# EAGLE schematic HydraRelayBoard (EAGLE 5.10)
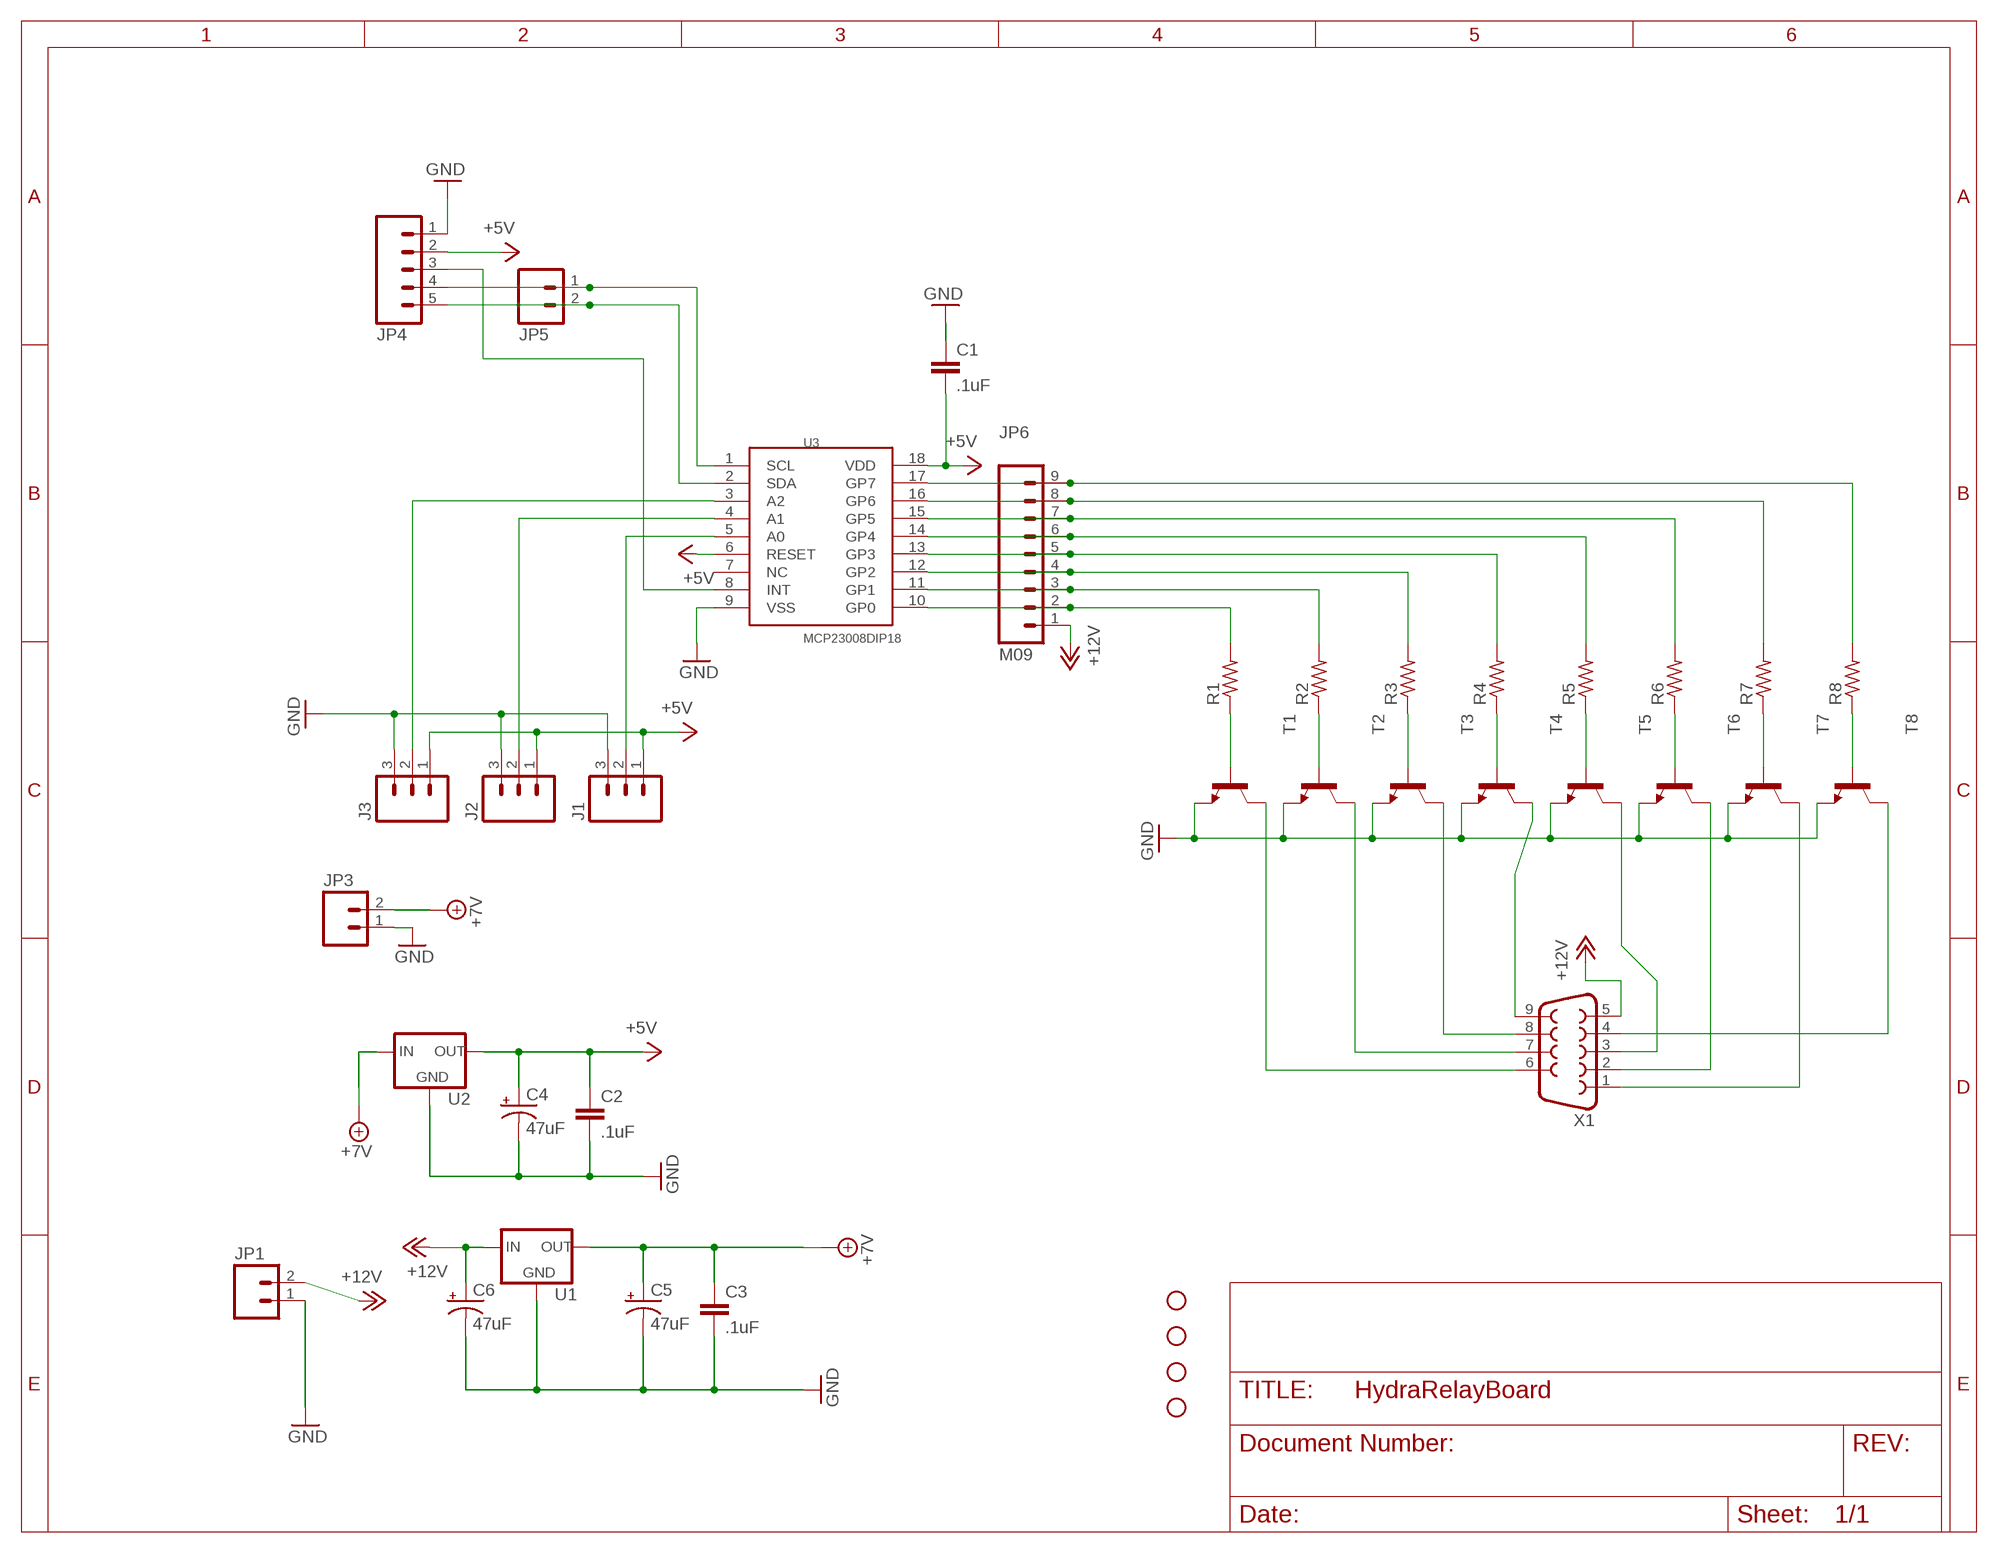
[diagram p0: schematic, sheet 1]

## Parts
C1  .1uF  CAPPTH  [CAP-PTH-SMALL]
C2  .1uF  CAPPTH  [CAP-PTH-SMALL]
C3  .1uF  CAPPTH  [CAP-PTH-SMALL]
C4  47uF  CAP_POL5MMPTH  [CAP5MM2MM]
C5  47uF  CAP_POL5MMPTH  [CAP5MM2MM]
C6  47uF  CAP_POL5MMPTH  [CAP5MM2MM]
J1  M03PTH  [1X03]
J2  M03PTH  [1X03]
J3  M03PTH  [1X03]
JP1  M02POLAR  [MOLEX-1X2]
JP3  M02POLAR  [MOLEX-1X2]
JP4  M05PTH  [1X05]
JP5  M02PTH  [1X02]
JP6  M09  [1X09]
JP9  STAND-OFF  [STAND-OFF]
JP10  STAND-OFF  [STAND-OFF]
JP11  STAND-OFF  [STAND-OFF]
JP12  STAND-OFF  [STAND-OFF]
R1  R-US_0204/5  [0204/5]
R2  R-US_0204/5  [0204/5]
R3  R-US_0204/5  [0204/5]
R4  R-US_0204/5  [0204/5]
R5  R-US_0204/5  [0204/5]
R6  R-US_0204/5  [0204/5]
R7  R-US_0204/5  [0204/5]
R8  R-US_0204/5  [0204/5]
T1  2N2222  [TO92-EBC-OVAL]
T2  2N2222  [TO92-EBC-OVAL]
T3  2N2222  [TO92-EBC-OVAL]
T4  2N2222  [TO92-EBC-OVAL]
T5  2N2222  [TO92-EBC-OVAL]
T6  2N2222  [TO92-EBC-OVAL]
T7  2N2222  [TO92-EBC-OVAL]
T8  2N2222  [TO92-EBC-OVAL]
U1  V_REG_78XXSINK  [TO220-IGO]
U2  V_REG_78XXSINK  [TO220-IGO]
U3  MCP23008DIP18  [DIL18]
X1  DB9  [DB9]

## Nets
+5V: C1.2 C2.1 C4.+ J1.1 J2.1 J3.1 JP4.2 U2.OUT U3.6(RESET) U3.18(VDD)
+7V: C3.1 C5.+ JP3.2 U1.OUT U2.IN
+12V: C6.+ JP1.2 JP6.1 U1.IN X1.5
GND: C1.1 C2.2 C3.2 C4.- C5.- C6.- J1.3 J2.3 J3.3 JP1.1 JP3.1 JP4.1 T1.E T2.E T3.E T4.E T5.E T6.E T7.E T8.E U1.GND U2.GND U3.9(VSS)
N$3: JP4.3 U3.8(INT)
N$6: J3.2 U3.3(A2)
N$7: J2.2 U3.4(A1)
N$8: J1.2 U3.5(A0)
N$9: JP4.4 JP5.1 U3.1(SCL)
N$10: T1.C X1.6
N$11: T2.C X1.7
N$12: JP6.7 R6.2 U3.15(GP5)
N$13: JP6.6 R5.2 U3.14(GP4)
N$14: JP6.5 R4.2 U3.13(GP3)
N$15: JP6.4 R3.2 U3.12(GP2)
N$16: JP6.3 R2.2 U3.11(GP1)
N$17: JP6.2 R1.2 U3.10(GP0)
N$18: JP4.5 JP5.2 U3.2(SDA)
N$19: JP6.9 R8.2 U3.17(GP7)
N$20: JP6.8 R7.2 U3.16(GP6)
N$21: T3.C X1.8
N$22: T4.C X1.9
N$23: R1.1 T1.B
N$24: R2.1 T2.B
N$25: R3.1 T3.B
N$26: R4.1 T4.B
N$28: R5.1 T5.B
N$29: R6.1 T6.B
N$30: R7.1 T7.B
N$31: R8.1 T8.B
N$32: T5.C X1.3
N$33: T6.C X1.2
N$34: T7.C X1.1
N$35: T8.C X1.4
Unconnected: U3.7(NC)

## Library data of the parts
C1-C3 = _allyourbase:CAP: Capacitor Standard 0603 ceramic capacitor, and 0.1" leaded capacitor.
C4-C6 = _allyourbase:CAP_POL: Capacitor Polarized These are standard SMD and PTH capacitors. Normally 10uF, 47uF, and 100uF in electrolytic and tantalum varieties. Always verify the external diameter of the through hole cap, it varies with capacity, voltage, and manufacturer. The EIA devices should be standard.
J1-J3 = _allyourbase:M03: Header 3 Standard 3-pin 0.1" header. Use with straight break away headers (SKU : PRT-00116), right angle break away headers (PRT-00553), swiss pins (PRT-00743), machine pins (PRT-00117), and female headers (PRT-00115). Molex polarized connector foot print use with SKU : PRT-08232 with associated crimp pins and housings.
JP1 JP3 JP5 = _allyourbase:M02: Header 2 Standard 2-pin 0.1" header. Use with straight break away headers (SKU : PRT-00116), right angle break away headers (PRT-00553), swiss pins (PRT-00743), machine pins (PRT-00117), and female headers (PRT-00115). Molex polarized connector foot print use with SKU : PRT-08233 with associated crimp pins and housings.
JP4 = _allyourbase:M05: Header 5 Standard 5-pin 0.1" header. Use with straight break away headers (SKU : PRT-00116), right angle break away headers (PRT-00553), swiss pins (PRT-00743), machine pins (PRT-00117), and female headers (PRT-00115). Molex polarized connector foot print use with SKU : PRT-08230 with associated crimp pins and housings.
JP6 = SparkFun:M09: Header 9 Standard 9-pin 0.1" header. Use with straight break away headers (SKU : PRT-00116), right angle break away headers (PRT-00553), swiss pins (PRT-00743), machine pins (PRT-00117), and female headers (PRT-00115).
JP9-JP12 = SparkFun:STAND-OFF: Stand Off This is the mechanical footprint for a #4 phillips button head screw. Use the keepout ring to avoid running the screw head into surrounding components. SKU : PRT-00447
R1-R8 = _allyourbase:R-US_: RESISTOR, American symbol
T1-T8 = adafruit:2N2222: NPN TRANSISTOR Big oval pads
U1 U2 = SparkFun:V_REG_78XX: Voltage Regulator Standard 7805 5V regulator. IGO (Input Ground Output). Spark Fun Electronics SKU : COM-00107
U3 = _allyourbase:MCP23008
X1 = SparkFun:DB9: DB9 Connector Standard DB9 (D-Sub 9) serial connector. Can be used for CAN bus as well as RS485 and RS232. Footprint production proven. Spark Fun Electronics SKU : PRT-00429